# EAGLE design lpf-5th-order (EAGLE 9.5.1)
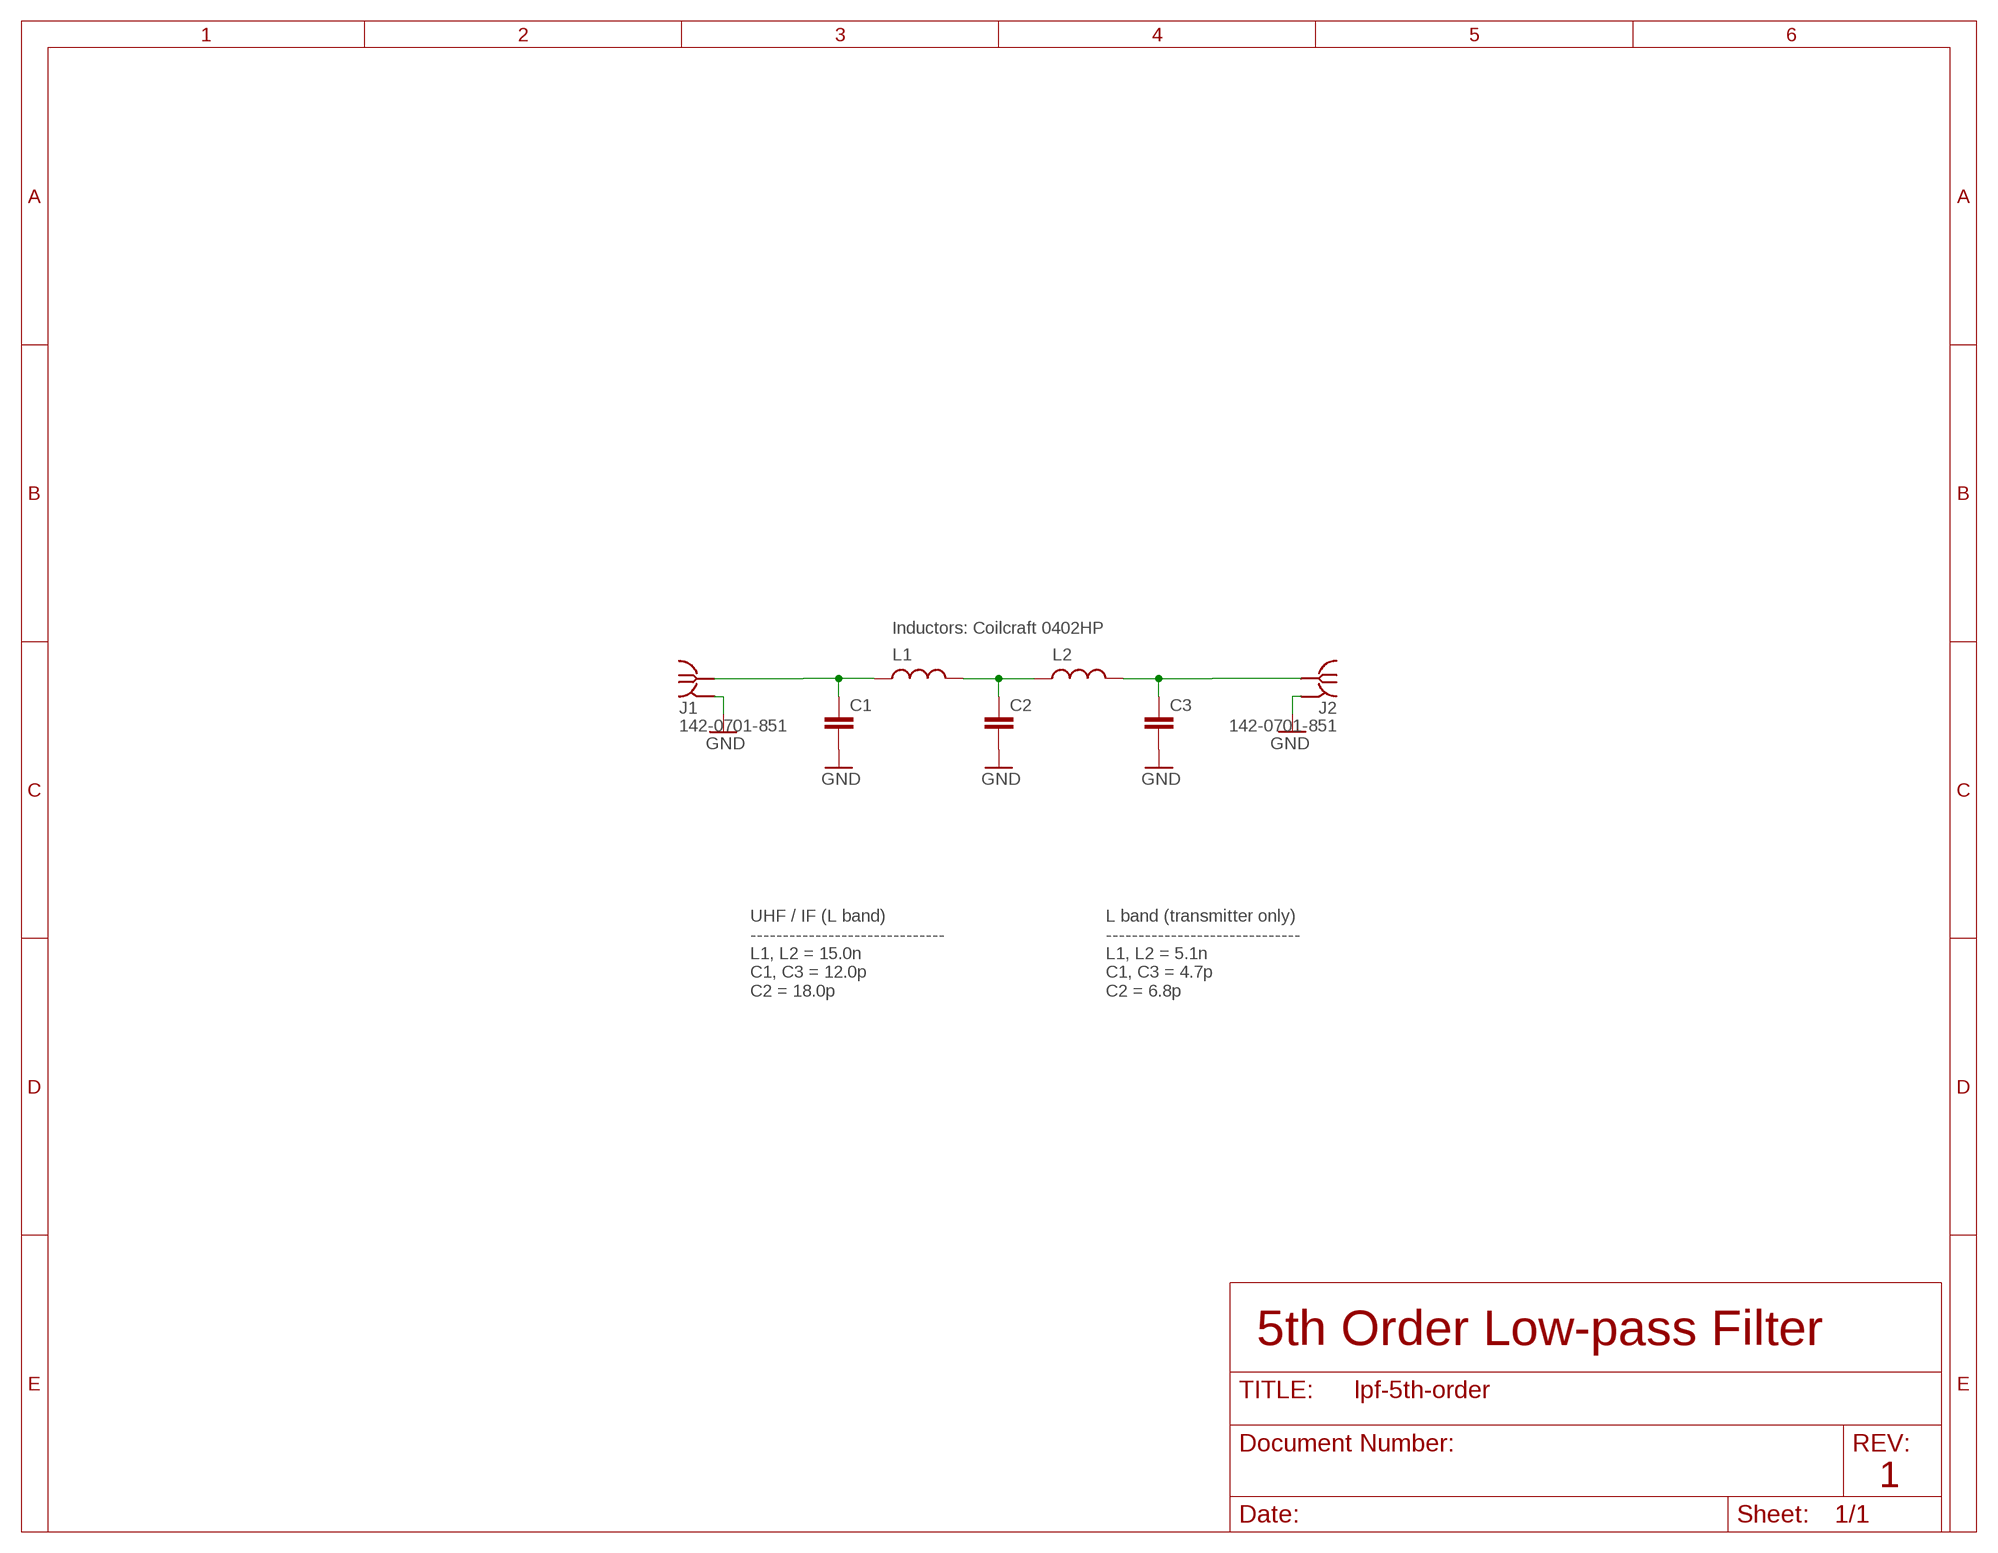
[diagram p0: schematic, sheet 1]

## Parts
C1  C-EU0402-C-NOSILK  [.0402-C-NOSILK]
C2  C-EU0402-C-NOSILK  [.0402-C-NOSILK]
C3  C-EU0402-C-NOSILK  [.0402-C-NOSILK]
J1  142-0701-851  [142-0701-851]
J2  142-0701-851  [142-0701-851]
L1  L-US0402-C-NOSILK  [.0402-C-NOSILK]
L2  L-US0402-C-NOSILK  [.0402-C-NOSILK]

## Nets
GND: C1.2 C2.2 C3.2 J1.GND1(GND) J1.GND2(GND) J1.GND3(GND) J1.GND4(GND) J2.GND1(GND) J2.GND2(GND) J2.GND3(GND) J2.GND4(GND)
N$1 [RF]: C2.1 L1.2 L2.1
RF-IN [RF]: C1.1 J1.RF1(RF) L1.1
RF-OUT [RF]: C3.1 J2.RF1(RF) L2.2

## Notes on the sheet
- Inductors: Coilcraft 0402HP
- UHF / IF (L band)
  ------------------------------
  L1, L2 = 15.0n
  C1, C3 = 12.0p
  C2 = 18.0p
- L band (transmitter only)
  ------------------------------
  L1, L2 = 5.1n
  C1, C3 = 4.7p
  C2 = 6.8p
- 5th Order Low-pass Filter
- 1

## Library data of the parts
C1-C3 = oresat-rcl:C-EU: CAPACITOR, European symbol
J1 J2 = J-Cinch-142-0701-851-SMA-end-launch:142-0701-851: SMA Jack 50Ω - End Launch Source: Datasheet <https://belfuse.com/resources/productinformations/cinchconnectivitysolutions/johnson/pi-ccs-john-142-0701-851.pdf>
L1 L2 = oresat-rcl:L-US: INDUCTOR, American symbol

## Net classes
1 RF: clearance 0.5 mm

## Board
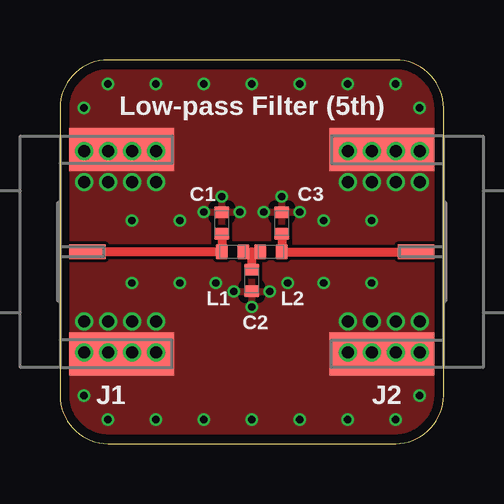
[diagram p1: board, top side]
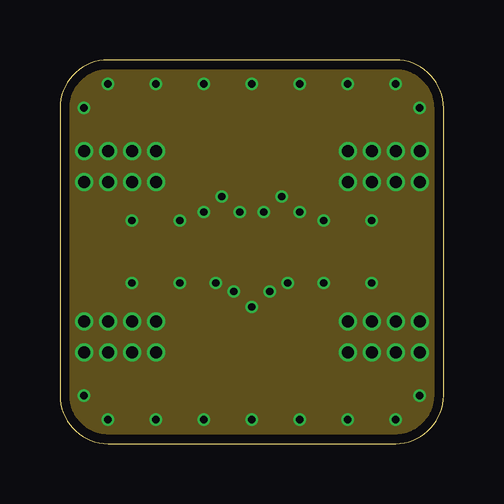
[diagram p2: board, inner layer Route2]
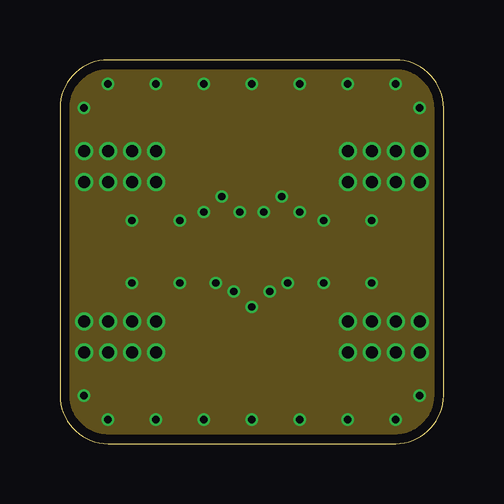
[diagram p3: board, inner layer Route15]
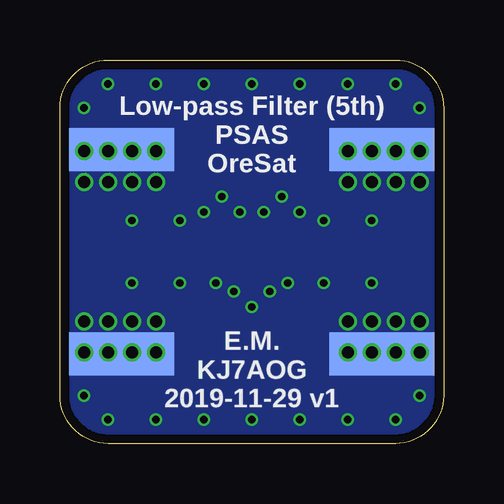
[diagram p4: board, bottom side, seen from below]

Size 16 x 16 mm. Coordinates in mm from the lower left corner, seen from the top.
Outline: 0,14 0,2 arc90 2,0 14,0 arc90 16,2 16,14 arc90 14,16 2,16 arc90 0,14
Copper layers (1*2*15*16): Top 0.035559375mm / dielectric 0.17018125mm / Route2 0.01778125mm / dielectric 47mil / Route15 0.01778125mm / dielectric 0.17018125mm / Bottom 0.035559375mm
Design rules "oshpark-4layer-tented": minimum track width 5mil, minimum drill 10mil, track to track 5mil, track to pad 5mil, pad to pad 5mil, via to via 5mil, smd to smd 5mil, copper to edge 15mil, drill to drill 6mil, minimum pad ring 4mil, minimum via ring 4mil, stop-mask expansion 2.5mil, vias tented up to drill 20mil, thermal gap 10mil

### Footprints (pad centres in the part's own frame; a part is rotated, then mirrored left to right if it is on the bottom)
.0402-C-NOSILK = smd 0.5 x 0.6: 1 -0.45,0; 2 0.45,0
142-0701-851 = smd 1.8 x 4.37: GND1 -4.255,-2.566; GND2 4.255,-2.566 | smd 1.8 x 4.37 bottom: GND3 -4.255,-2.566; GND4 4.255,-2.566 | smd 0.6 x 1.53: RF1 0,-1.146

### Placement (x,y rotation side)
C1  6.75,9.2 90 top
C2  8,6.8 270 top
C3  9.25,9.2 90 top
J1  0,8 90 top
J2  16,8 270 top
L1  7.2,8 0 top
L2  8.8,8 0 top

### Tracks (layer width: path | path; a pad name or v marks a point on that pad's centre or on a via)
GND  (via drill 0.3, 0.5)
  other vias: 1,12.2 2,12.2 3,12.2 4,12.2 1,10.9 2,10.9 3,10.9 4,10.9 1,3.8 2,3.8 3,3.8 4,3.8 4,5.1 3,5.1 2,5.1 1,5.1 12,3.8 13,3.8 14,3.8 15,3.8 15,5.1 14,5.1 13,5.1 12,5.1 12,12.2 13,12.2 14,12.2 15,12.2 12,10.9 13,10.9 14,10.9 15,10.9 3,6.7 5,6.7 13,6.7 11,6.7 3,9.3 5,9.3 13,9.3 11,9.3 1,2 2,1 14,1 15,2 4,1 6,1 8,1 10,1 12,1 1,14 2,15 4,15 6,15 8,15 10,15 12,15 14,15 15,14 6.75,10.3 8,5.7 9.25,10.3 6,9.65 7.5,9.65 8.5,9.65 10,9.65 7.25,6.35 8.75,6.35 9.5,6.7 6.5,6.7
  pour Top: 0,16 16,16 16,0 0,0
  pour Route2: 0,16 16,16 16,0 0,0
  pour Route15: 0,16 16,16 16,0 0,0
  pour Bottom: 0,16 16,16 16,0 0,0
  pour Top (no thermals): 0,14 5,14 5,2 0,2
  pour Top (no thermals): 11,14 16,14 16,2 11,2
  pour Bottom (no thermals): 0,14 5,14 5,2 0,2
  pour Bottom (no thermals): 11,14 16,14 16,2 11,2
N$1
  Top 0.38: L1.2 8,8 | 8,8 L2.1 | C2.1 8,8
RF-IN
  Top 0.38: C1.1 L1.1 J1.RF1
RF-OUT
  Top 0.38: C3.1 L2.2 J2.RF1

### Text on the board
tPlace: Low-pass Filter (5th)
bPlace: Low-pass Filter (5th) / PSAS / OreSat | E.M. / KJ7AOG / 2019-11-29 v1